# EAGLE design Powerlolu_Pololu (EAGLE 6.2)
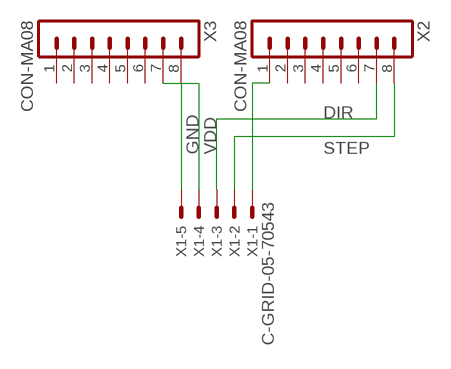
[diagram p0: schematic, sheet 1]

## Parts
X1  C-GRID-05-70543  [70543-05]
X2  CON-MA08  [MA08]
X3  CON-MA08  [MA08]

## Nets
DIR: X1.3 X2.7
GND: X1.5 X3.8
N$2: X1.1 X2.1
STEP: X1.2 X2.8
VDD: X1.4 X3.7
Unconnected: X2.2 X2.3 X2.4 X2.5 X2.6 X3.1 X3.2 X3.3 X3.4 X3.5 X3.6

## Library data of the parts
X1 = con-molex:C-GRID-05: CONNECTOR wire to board 2.54 mm (0.100") pitch header; OC_FARNELL: unknown; OC_NEWARK: unknown
X2 X3 = myLib:CON-MA08

## Board
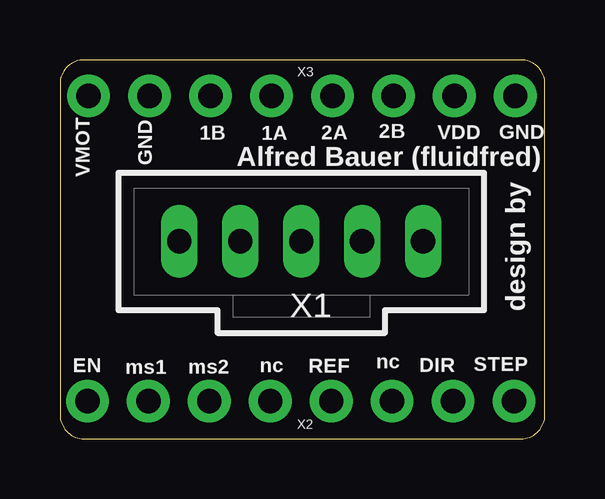
[diagram p1: board, top side]
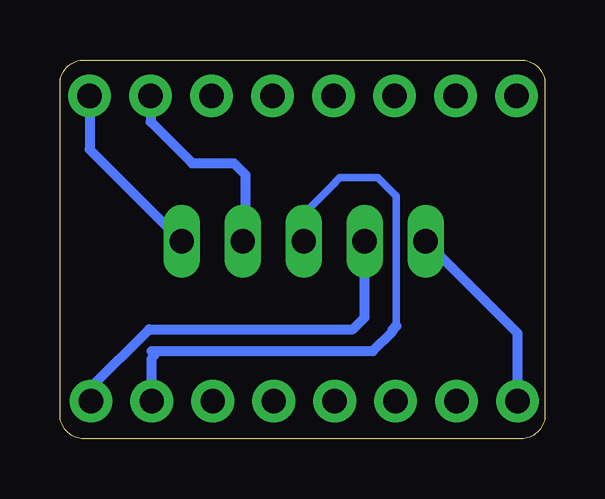
[diagram p2: board, bottom side, seen from below]

Size 20.2 x 15.8 mm. Coordinates in mm from the lower left corner, seen from the top.
Outline: 19.2,0 arc90 20.2,1 20.2,14.8 arc90 19.2,15.8 1,15.8 arc90 0,14.8 0,1 arc90 1,0 19.2,0
Copper layers (1*16): Top 0.035mm / dielectric 1.5mm / Bottom 0.035mm
Design rules: minimum track width 8mil, minimum drill 0.3mm, track to track 8mil, track to pad 8mil, pad to pad 8mil, via to via 8mil, smd to smd 0mil, copper to edge 0.35mm, drill to drill 8mil, minimum pad ring 10mil, minimum via ring 0.15mm, stop-mask expansion 2mil, vias tented up to drill 20mil, thermal gap 10mil

### Footprints (pad centres in the part's own frame; a part is rotated, then mirrored left to right if it is on the bottom)
70543-05 = drill 1.016 long: 1 -5.08,0; 2 -2.54,0; 3 0,0; 4 2.54,0; 5 5.08,0
MA08 = drill 1.016 pad 1.778: 1 -8.89,0; 2 -6.35,0; 3 -3.81,0; 4 -1.27,0; 5 1.27,0; 6 3.81,0; 7 6.35,0; 8 8.89,0

### Placement (x,y rotation side)
X1  10.05,8.23 0 top
X2  10.03,1.57 0 top
X3  10.08,14.3 0 top

### Tracks (layer width: path | path; a pad name or v marks a point on that pad's centre or on a via)
DIR
  Bottom 0.305: 6.19,4.7 6.19,10.13 6.96,10.9 8.54,10.9 8.73,10.71 8.73,10.69 9.82,9.6 9.82,8.46 X1.3
  Bottom 0.406: X2.7 16.38,3.37 16.29,3.46 16.29,3.56 16.39,3.66 7.17,3.66 6.35,4.48 6.35,4.54 6.19,4.7
GND
  Bottom 0.406: X3.8 18.97,12.07 X1.5
MS3  (via drill 0.9)
  other vias: 8.77,1.54
N$1  (via drill 0.9)
  other vias: 18.93,14.24
N$2
  Bottom 0.406: X2.1 1.14,4.4 X1.1
N$5  (via drill 0.9)
  other vias: 13.85,1.54
N$8  (via drill 0.9)
  other vias: 3.69,14.24
STEP
  Bottom 0.406: X2.8 18.92,2.14 16.49,4.57 8,4.57 7.51,5.06 X1.2 7.51,8.25 7.51,8.69 7.6,8.78
VDD
  Bottom 0.406: X3.7 16.43,13.22 14.7,11.49 12.96,11.49 12.48,11.01 12.48,8.34 X1.4

### Text on the board
tPlace: VMOT | GND | 1B | 1A | 2A | 2B | VDD | GND | Alfred Bauer (fluidfred) | design by | EN | nc | DIR | STEP | ms1 | ms2 | nc | REF